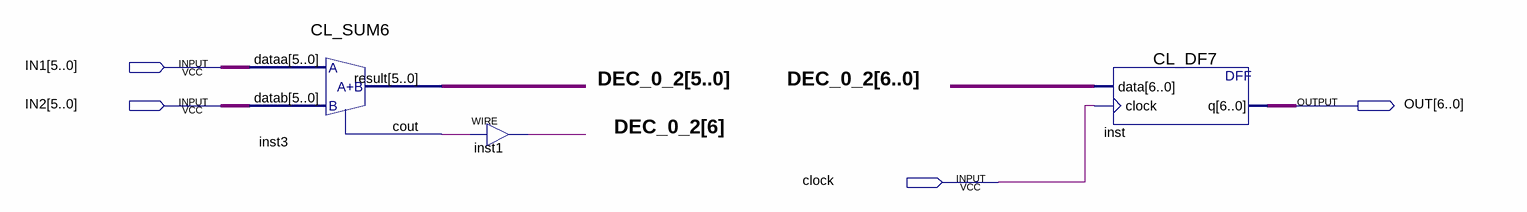
[diagram p0: schematic sheet]
// Quartus schematic CL_SUM6_BL.bdf as structural Verilog: 3 symbols, 4 pins
module CL_SUM6_BL (
  input  [5:0] IN1,
  input  [5:0] IN2,
  input  clock,
  output [6:0] OUT
);

  wire inst3_cout;
  wire [6:0] DEC_0_2;

  CL_SUM6 inst3 (.dataa(IN1), .datab(IN2), .result(DEC_0_2[5:0]), .cout(inst3_cout));
  assign DEC_0_2[6] = inst3_cout;  // WIRE inst1
  CL_DF7 inst (.data(DEC_0_2), .clock(clock), .q(OUT));
endmodule
